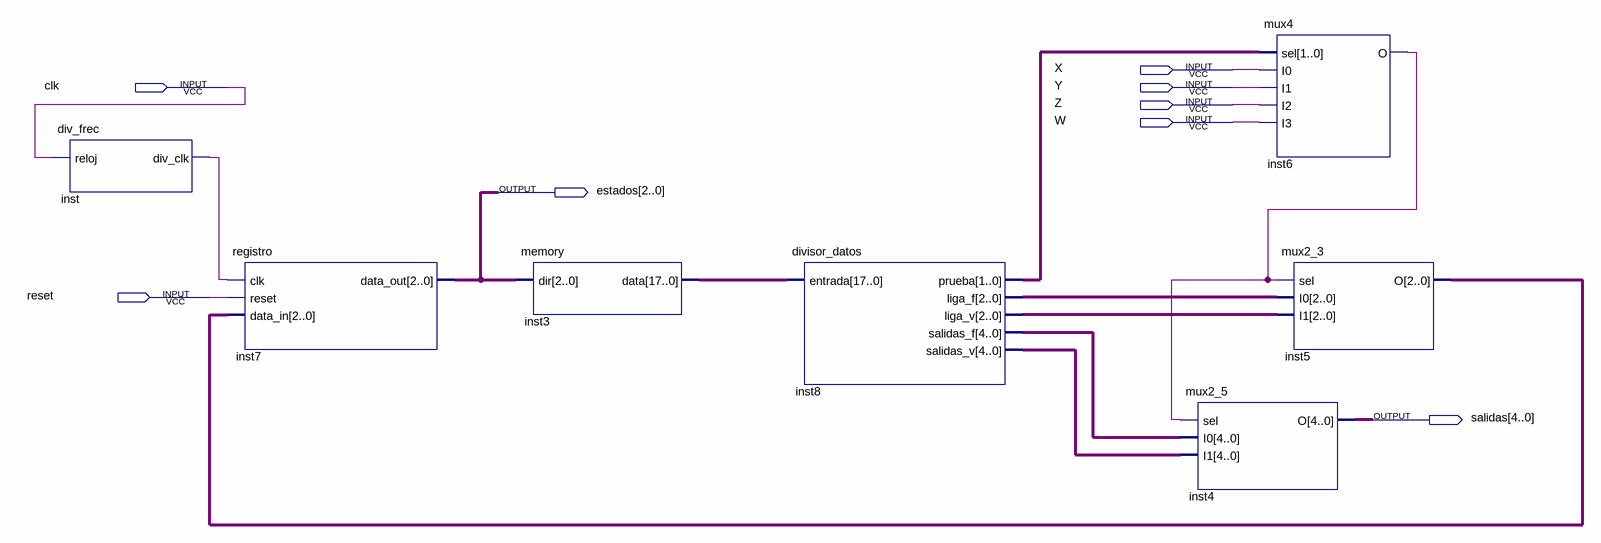
[diagram p0: schematic sheet]
// Quartus schematic practica4.bdf as structural Verilog: 7 symbols, 8 pins
module practica4 (
  input  X,
  input  clk,
  input  Y,
  input  Z,
  input  W,
  input  reset,
  output [2:0] estados,
  output [4:0] salidas
);

  wire inst6_o, inst_div_clk;
  wire [1:0] inst8_prueba;
  wire [2:0] inst5_o, inst8_liga_f, inst8_liga_v;
  wire [4:0] inst8_salidas_f, inst8_salidas_v;
  wire [17:0] inst3_data;

  div_frec inst (.reloj(clk), .div_clk(inst_div_clk));
  registro inst7 (.clk(inst_div_clk), .reset(reset), .data_in(inst5_o), .data_out(estados));
  memory inst3 (.dir(estados), .data(inst3_data));
  divisor_datos inst8 (
    .entrada(inst3_data), .prueba(inst8_prueba), .liga_f(inst8_liga_f), .liga_v(inst8_liga_v),
    .salidas_f(inst8_salidas_f), .salidas_v(inst8_salidas_v));
  mux2_5 inst4 (.sel(inst6_o), .I0(inst8_salidas_f), .I1(inst8_salidas_v), .O(salidas));
  mux4 inst6 (.sel(inst8_prueba), .I0(X), .I1(Y), .I2(Z), .I3(W), .O(inst6_o));
  mux2_3 inst5 (.sel(inst6_o), .I0(inst8_liga_f), .I1(inst8_liga_v), .O(inst5_o));
endmodule
